# Altium project biggie.PrjPcb
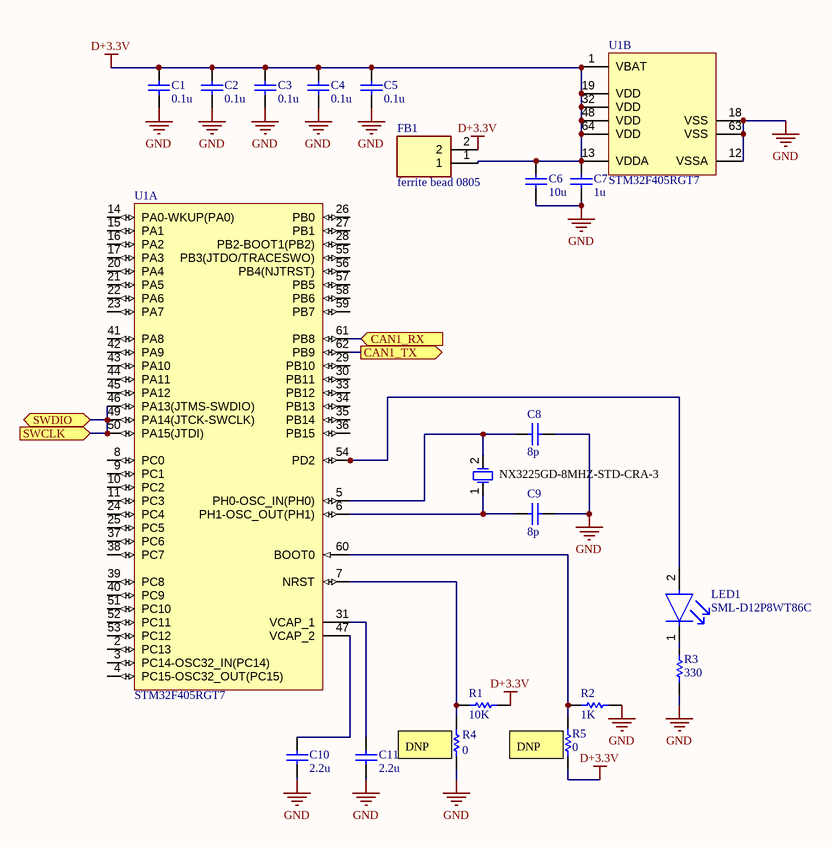
[diagram p0: MCU.SchDoc]
1 sheet, 20 parts. Net scope: flat (ports and power ports of the same name join across sheets).

## Sheet MCU.SchDoc
size 420 x 297 mm; SheetNumber: 1; SheetTotal: 1

### Parts
?  NX3225GD-8MHZ-STD-CRA-3  [NDK-NX3225GD-8MHZ-STD-CRA-3_V]
C1  value 0.1u  (hidden comment: Capacitor)
C2  value 0.1u  (hidden comment: Capacitor)
C3  value 0.1u  (hidden comment: Capacitor)
C4  value 0.1u  (hidden comment: Capacitor)
C5  value 0.1u  (hidden comment: Capacitor)
C6  value 10u  (hidden comment: Capacitor)
C7  value 1u  (hidden comment: Capacitor)
C8  value 8p  (hidden comment: Capacitor)
C9  value 8p  (hidden comment: Capacitor)
C10  value 2.2u  (hidden comment: Capacitor)
C11  value 2.2u  (hidden comment: Capacitor)
FB1  ferrite bead 0805  [BEADC2012X105N]
LED1  SML-D12P8WT86C  [FP-SML-D12-MFG]
R1  value 10K  (hidden comment: Resistor)
R2  value 1K  (hidden comment: Resistor)
R3  value 330  (hidden comment: Resistor)
R4  value 0  (hidden comment: Resistor)
R5  R3: 0  (hidden comment: Resistor)
U1  STM32F405RGT7  [STM-LQFP64_N]  (parts A,B of 2)

### Ports
CAN1_RX (in), CAN1_TX (out), SWCLK (in), SWDIO (bidir)

### Nets
D+3.3V: C1.2 C2.2 C3.2 C4.2 C5.2 C6.2 C7.2 FB1.1 FB1.2 R1.2 R5.1 U1.1(VBAT) U1.13(VDDA) U1.19(VDD) U1.32(VDD) U1.48(VDD) U1.64(VDD)
GND: C1.1 C2.1 C3.1 C4.1 C5.1 C6.1 C7.1 C8.2 C9.2 C10.1 C11.1 R2.2 R3.1 R4.1 U1.12(VSSA) U1.18(VSS) U1.63(VSS)
Net?_1: ?.1 C9.1 U1.6(PH1-OSC_OUT(PH1))
Net?_2: ?.2 C8.1 U1.5(PH0-OSC_IN(PH0))
NetC10_2: C10.2 U1.47(VCAP_2)
NetC11_2: C11.2 U1.31(VCAP_1)
NetLED1_1: LED1.1(C) R3.2
NetLED1_2: LED1.2(A) U1.54(PD2)
NetR1_1: R1.1 R4.2 U1.7(NRST)
NetR2_1: R2.1 R5.2 U1.60(BOOT0)
NetU1_46: U1.46(PA13(JTMS-SWDIO)) U1.49(PA14(JTCK-SWCLK)) U1.50(PA15(JTDI)) ; port SWCLK, port SWDIO
NetU1_61: U1.61(PB8) ; port CAN1_RX
NetU1_62: U1.62(PB9) ; port CAN1_TX

Not connected (* = marked no-connect by the designer): U1 2(PC13) 3(PC14-OSC32_IN(PC14)) 4(PC15-OSC32_OUT(PC15)) 8(PC0) 9(PC1) 10(PC2) 11(PC3) 14(PA0-WKUP(PA0)) 15(PA1) 16(PA2) 17(PA3) 20(PA4) 21(PA5) 22(PA6) 23(PA7) 24(PC4) 25(PC5) 26(PB0) 27(PB1) 28(PB2-BOOT1(PB2)) 29(PB10) 30(PB11) 33(PB12) 34(PB13) 35(PB14) 36(PB15) 37(PC6) 38(PC7) 39(PC8) 40(PC9) 41(PA8) 42(PA9) 43(PA10) 44(PA11) 45(PA12) 51(PC10) 52(PC11) 53(PC12) 55(PB3(JTDO/TRACESWO)) 56(PB4(NJTRST)) 57(PB5) 58(PB6) 59(PB7)

### Notes on the sheet
- (near R4) DNP
- (near R5) DNP
- THIS DOCUMENT AND THE DATA DISCLOSED HEREIN OR
- HEREWITH IS THE PROPERTY OF ALTIUM LIMITED AND MAY
- DWG NO:
- REVISION
- REV:
- DESCRIPTION
- DATE
- APPROVED
- BE FREELY DISTRIBUTED IN WHOLE. NO RIGHTS ARE
- RESERVED OR EXPRESS OR IMPLIED WARANTEE GIVEN.
- ENG:
- APPROVALS
- PROJECT
- DSN:
- CHK:
- REFERENCE DOCUMENTS
- PROJECT REVISION:
- TITLE
- DOCUMENT REVISION:
- DESIGN ITEM:
- BOM:
- FAB DWG:
- PCB DWG:
- ASSY DWG:
- SCALE:
- A3
- SIZE
- CAGE CODE
- FILE NAME
- DWG NO.
- SHEET
- OF
- REV

### Library data of the parts
? = CMP-2000-07595-1: Crystal Unit, 8 MHz, 8 pF, -40 to 150 degC, 2-Pin SMD, RoHS, Tape and Reel; Manufacturer: NDK; Load Capacitance: 8pF; ESR (Equivalent Series Resistance): 500Ohm; Frequency Tolerance: 50ppm; Frequency Stability: 150ppm; Frequency: 8MHz; Case/Package: SMD/SMT; Datasheet Version: 11/2016; Min Operating Temperature: -40degC; Packaging: TapeandReel; Width: 0.098inch; Package Quantity: 3000; Number of Pins: 2; Package Description: 2-Pin Surface Mount Device, Body 3.2 x 2.5 mm; RoHSCompliant: True; Package Reference: NX3225GD-8MHZ-STD-CRA-3; Datasheet URL: http://www.ndk.com/images/products/catalog/c_NX3225GD-STD-CRA-3_e.pdf; Mounting Technology: SurfaceMount; Length: 0.126inch; Mount: SurfaceMount; Manufacturer URL: http://www.ndk.com/en/; Max Operating Temperature: 150degC; Height: 0.039inch
C1-C11 = Capacitor: SimulationGenericComponent: True
FB1 = FBMJ2125HS250NT: Manufacturer_Name: TAIYO YUDEN; Datasheet Link: https://mouser.componentsearchengine.com/Datasheets/1/FBMJ2125HS250NT.pdf; Height: 1.05mm; Manufacturer_Part_Number: FBMJ2125HS250NT; Mouser Part Number: 963-FBMJ2125HS250NT; Mouser Price/Stock: https://www.mouser.co.uk/ProductDetail/TAIYO-YUDEN/FBMJ2125HS250NT?qs=I6KAKw0tg2w%2F7qNkMvc%2FCQ%3D%3D; Arrow Part Number: FBMJ2125HS250NT; Arrow Price/Stock: null?region=nac
LED1 = CMP-08952-000001-1: LED GREEN 1608 SMD; Manufacturer: Rohm; Forward Current: 20mA; Luminous Intensity: 6.3mcd; Wavelength: 560nm; Automotive Grade: Grade 3; Reverse Voltage: 5V; Forward Voltage: 2.2V; Power Dissipation: 54mW; Led Orientation: Top View; Temperature Range Low: -40°C; Automotive: Yes; Height: 0.65mm; Manufacturer Part Number: SML-D12P8WT86C; Device Class L3: unset; Octopart: https://octopart.com/sml-d12p8wt86c-rohm-77740213; Lead Free: Yes; Digikey Description: LED GREEN 1608 SMD; Temperature Range High: +85°C; ComponentLink2URL: https://www.rohm.com/datasheet/SML-D12P8W(C)/sml-d12x8(c)-e; ComponentLink2Description: Datasheet; RoHS: TRUE; Device Class L2: LEDs; Package: SML-D12; Category: Diode; Temperature: -40°C to +85°C; Mouser Description: LED Uni-Color Green Automotive 2-Pin Chip 0603(1608Metric) T/R; Colour: Green; Device Class L1: Optoelectronics
R1-R3 = Resistor: TC1: 0; SimulationGenericComponent: True; TC2: 0
R4 R5 = Resistor: SimulationGenericComponent: True; TC1: 0; TC2: 0
U1 = CMP-0243-00093-2: ARM Cortex-M4 32-bit MCU+FPU, 210 DMIPS, 1024 kB Flash, 192 kB Internal RAM, 51 I/Os, 64-pin LQFP, -40 to 105 degC, Tray; Manufacturer: STMicroelectronics; D/A Converter: 2x12-bit; Internal RAM Size (kB): 192; Supply Voltage(Vcc) min (V): 1.8; Supply Voltage(Vcc) max (V): 3.6; FLASH Size (Prog) (kB): 1024; I/Os (High Current): 51; Operating Frequency(F) (Processor speed) (MHz): 168; PackageVersion: Rev. 4, 06/2013; PackageDescription: 64-Pin Low Profile Quad Flat Package, 10 x 10 mm Body, 0.5 mm Pitch; Packing: Tray; ComponentLink2Description: Datasheet; PackageReference: LQFP64; ComponentLink1URL: http://www.st.com/web/en/home.html; ComponentLink2URL: http://www.st.com/st-web-ui/static/active/en/resource/technical/document/datasheet/DM00037051.pdf; ComponentLink1Description: Manufacturer URL; Core: ARM Cortex-M4; PartNumber: STM32F405RGT7; Mounting Technology: Surface Mount; DatasheetVersion: Rev. 4; ComponentLink3URL: http://www.st.com/st-web-ui/static/active/en/resource/technical/document/datasheet/DM00037051.pdf; ComponentLink3Description: Package Specification